# Altium schematic sheet Sheet1.SchDoc
size 420 x 297 mm; Address1: Address1; Address2: Address2; Address3: Address3; Address4: Address4; SheetNumber: 2; SheetTotal: 2; Scale: 1:1; Letter1Column: У; Разраб.: Иванов; Обозначение документа: АБВГ.123456.001 Э3; Пров.: Петров; Общее количество листов: 1; Наименование организации: ОАО "Ваша фирма"; Перв. применение: АБВГ.123456.001 Э3; Наименование изделия 1: Плата; Наименование изделия 2: Схема электрическая; Наименование изделия 3: принципиальная; Нач. отд.: Нач. отд.; Фамилия нач. отд.: Сидоров; CompanyName_1: ТПУ ИШНКБ ОЭИ; CompanyName_2: Группа 1А11
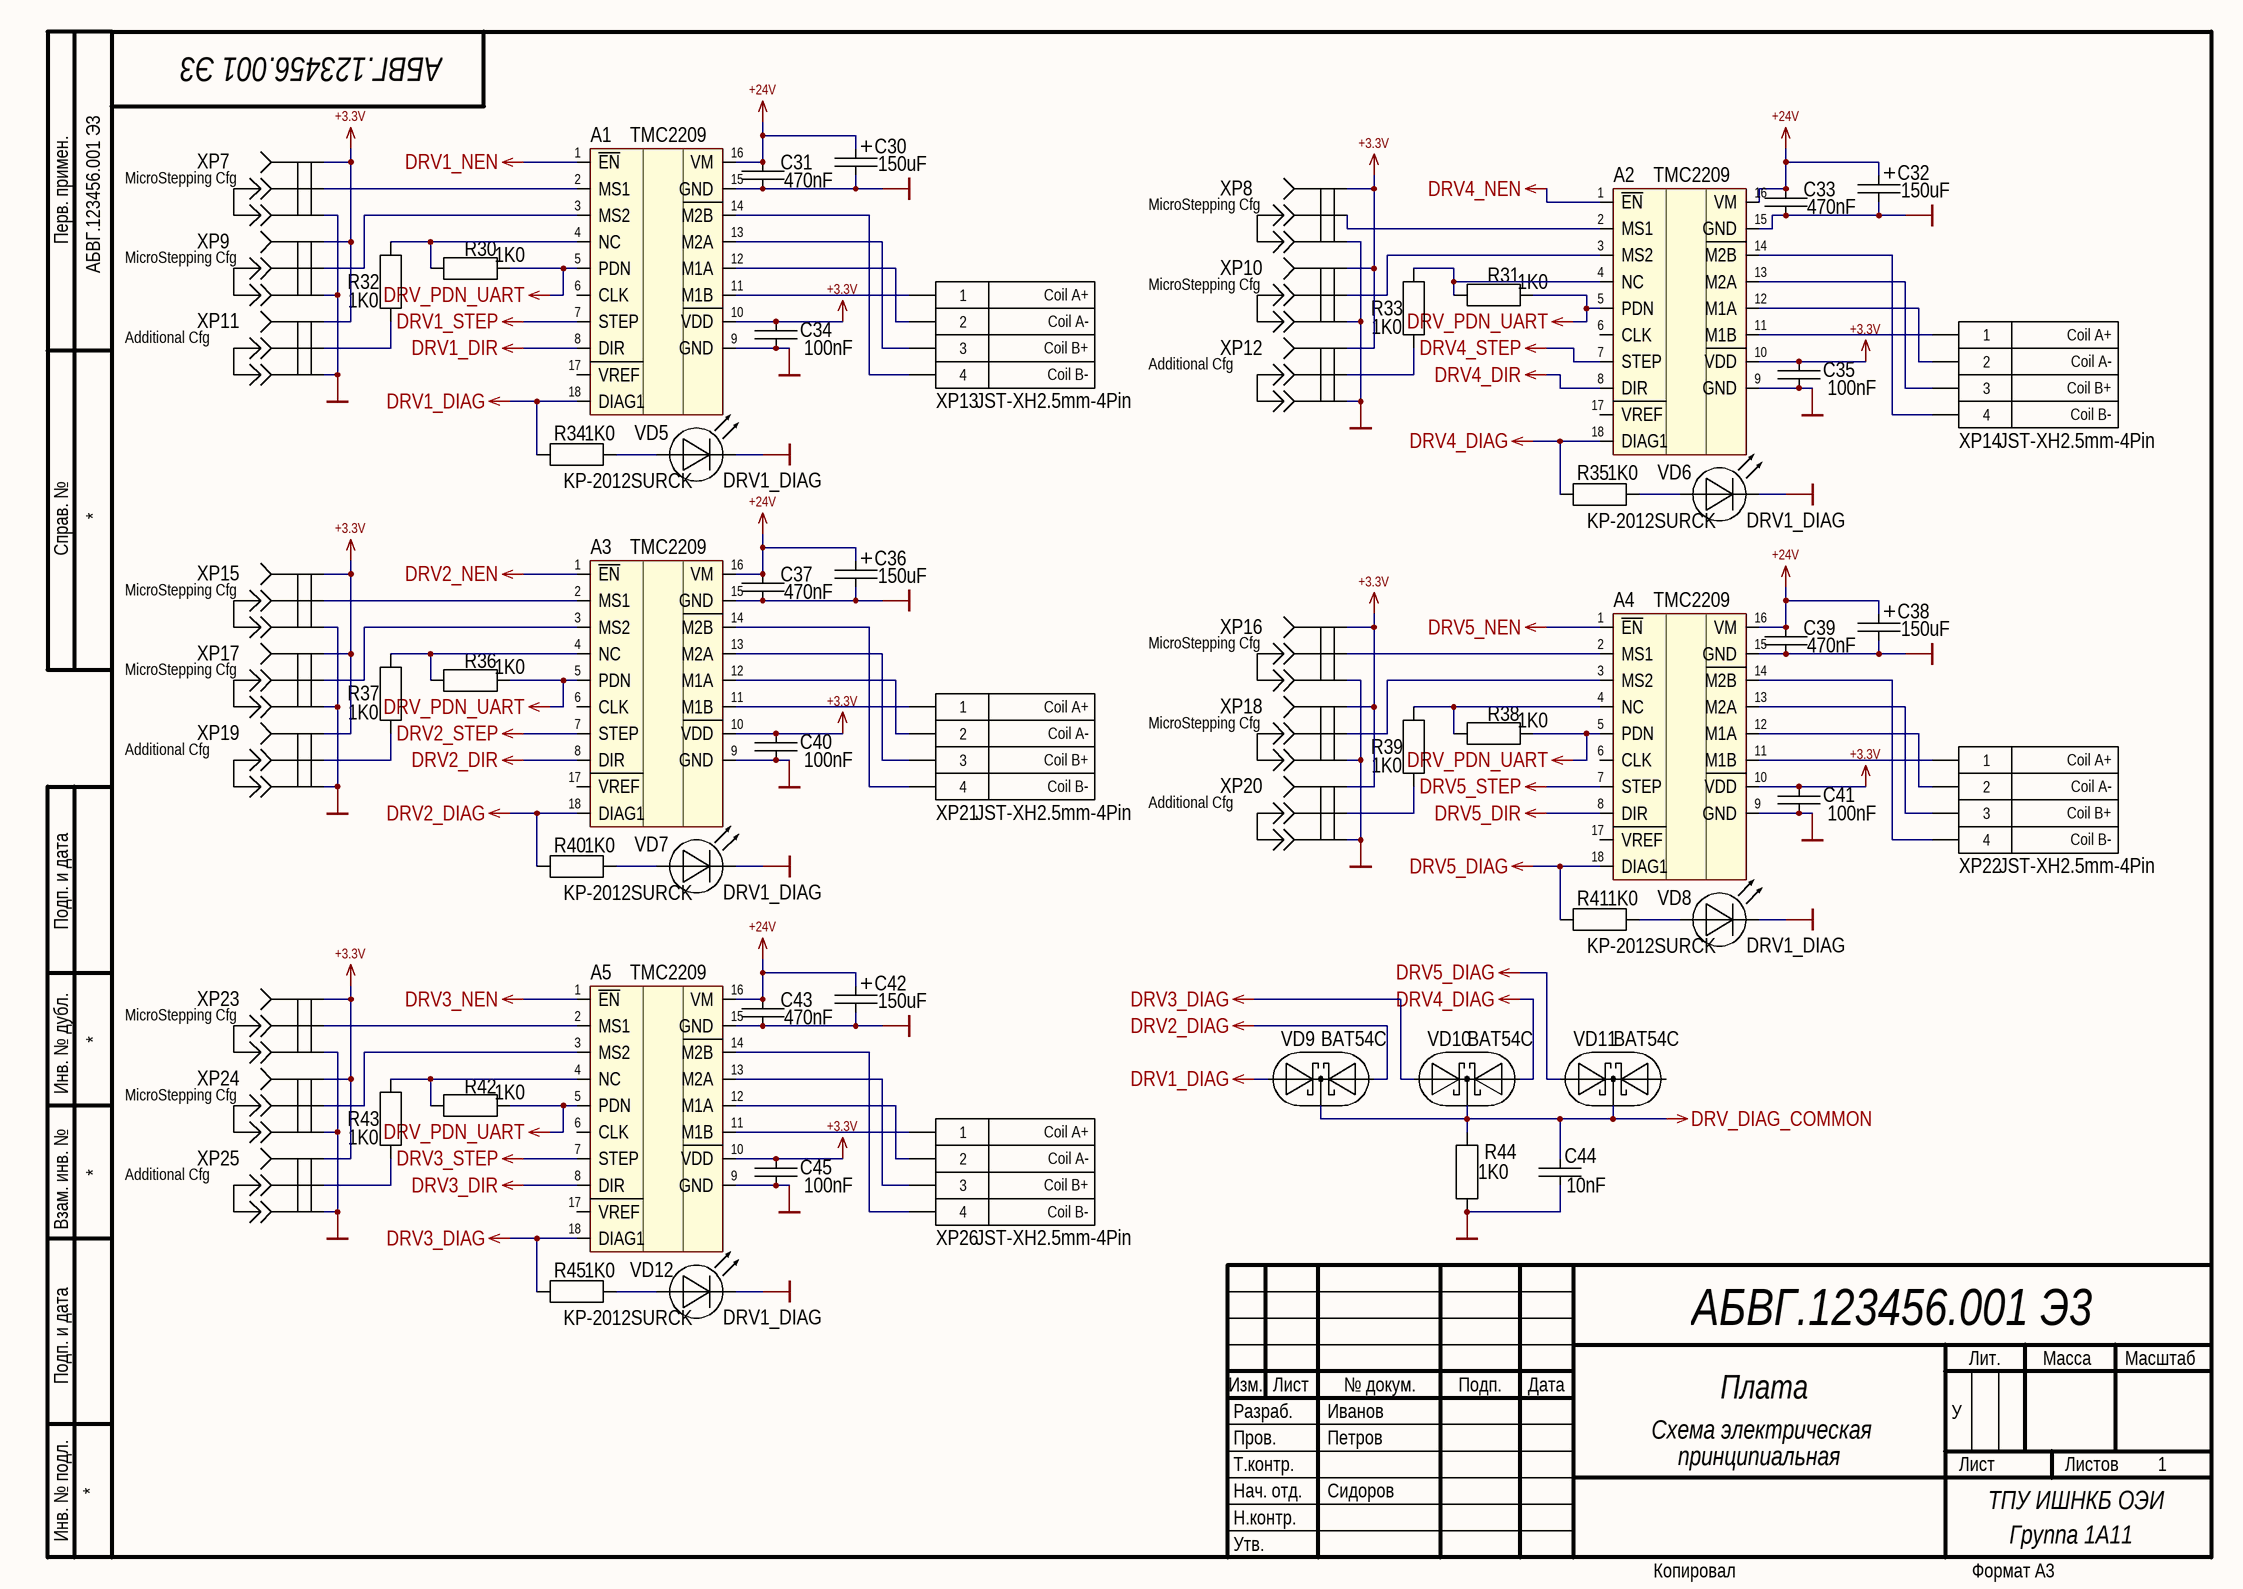
[diagram p0: Sheet1.SchDoc]

## Parts
A1  TMC2209  [TMC2209_module]
A2  TMC2209  [TMC2209_module]
A3  TMC2209  [TMC2209_module]
A4  TMC2209  [TMC2209_module]
A5  TMC2209  [TMC2209_module]
C30  value 150uF  [CapAl8X11.5X3.5RA]  (hidden comment: CapAl8X11.5X3.5mm 150uF, 35 V)
C31  value 470nF  [CAP0805]  (hidden comment: CAP0805 470nF±10%, 50 V, X7R)
C32  value 150uF  [CapAl8X11.5X3.5]  (hidden comment: CapAl8X11.5X3.5mm 150uF, 35 V)
C33  value 470nF  [CAP0805]  (hidden comment: CAP0805 470nF±10%, 50 V, X7R)
C34  value 100nF  [CAP0805]  (hidden comment: CAP0805 100nF±10%, 50 V, X7R)
C35  value 100nF  [CAP0805]  (hidden comment: CAP0805 100nF±10%, 50 V, X7R)
C36  value 150uF  [CapAl8X11.5X3.5RA]  (hidden comment: CapAl8X11.5X3.5mm 150uF, 35 V)
C37  value 470nF  [CAP0805]  (hidden comment: CAP0805 470nF±10%, 50 V, X7R)
C38  value 150uF  [CapAl8X11.5X3.5RA]  (hidden comment: CapAl8X11.5X3.5mm 150uF, 35 V)
C39  value 470nF  [CAP0805]  (hidden comment: CAP0805 470nF±10%, 50 V, X7R)
C40  value 100nF  [CAP0805]  (hidden comment: CAP0805 100nF±10%, 50 V, X7R)
C41  value 100nF  [CAP0805]  (hidden comment: CAP0805 100nF±10%, 50 V, X7R)
C42  value 150uF  [CapAl8X11.5X3.5RA]  (hidden comment: CapAl8X11.5X3.5mm 150uF, 35 V)
C43  value 470nF  [CAP0805]  (hidden comment: CAP0805 470nF±10%, 50 V, X7R)
C44  value 10nF  [CAP0805]  (hidden comment: CAP0805 10nF±5%, 50 V, NP0)
C45  value 100nF  [CAP0805]  (hidden comment: CAP0805 100nF±10%, 50 V, X7R)
R30  value 1K0  [RES0805]  (hidden comment: RES0805 1K0±5%)
R31  value 1K0  [RES0805]  (hidden comment: RES0805 1K0±5%)
R32  value 1K0  [RES0805]  (hidden comment: RES0805 1K0±5%)
R33  value 1K0  [RES0805]  (hidden comment: RES0805 1K0±5%)
R34  value 1K0  [RES0805]  (hidden comment: RES0805 1K0±5%)
R35  value 1K0  [RES0805]  (hidden comment: RES0805 1K0±5%)
R36  value 1K0  [RES0805]  (hidden comment: RES0805 1K0±5%)
R37  value 1K0  [RES0805]  (hidden comment: RES0805 1K0±5%)
R38  value 1K0  [RES0805]  (hidden comment: RES0805 1K0±5%)
R39  value 1K0  [RES0805]  (hidden comment: RES0805 1K0±5%)
R40  value 1K0  [RES0805]  (hidden comment: RES0805 1K0±5%)
R41  value 1K0  [RES0805]  (hidden comment: RES0805 1K0±5%)
R42  value 1K0  [RES0805]  (hidden comment: RES0805 1K0±5%)
R43  value 1K0  [RES0805]  (hidden comment: RES0805 1K0±5%)
R44  value 1K0  [RES0805]  (hidden comment: RES0805 1K0±5%)
R45  value 1K0  [RES0805]  (hidden comment: RES0805 1K0±5%)
VD5  Model: KP-2012SURCK  [LED0805 RED]  (hidden comment: KP-2012SURCK (2.0V, 25mA, LED0805 RED))
VD6  Model: KP-2012SURCK  [LED0805 RED]  (hidden comment: KP-2012SURCK (2.0V, 25mA, LED0805 RED))
VD7  Model: KP-2012SURCK  [LED0805 RED]  (hidden comment: KP-2012SURCK (2.0V, 25mA, LED0805 RED))
VD8  Model: KP-2012SURCK  [LED0805 RED]  (hidden comment: KP-2012SURCK (2.0V, 25mA, LED0805 RED))
VD9  Model: BAT54C  [SOT23-3 DIODE (A1A2C)]  (hidden comment: BAT54C (30 V, 200 mA, SOT23-3 DIODE (A1A2C)))
VD10  Model: BAT54C  [SOT23-3 DIODE (A1A2C)]  (hidden comment: BAT54C (30 V, 200 mA, SOT23-3 DIODE (A1A2C)))
VD11  Model: BAT54C  [SOT23-3 DIODE (A1A2C)]  (hidden comment: BAT54C (30 V, 200 mA, SOT23-3 DIODE (A1A2C)))
VD12  Model: KP-2012SURCK  [LED0805 RED]  (hidden comment: KP-2012SURCK (2.0V, 25mA, LED0805 RED))
XP7  PLS-3 1х3 Jumper  [PLS-1-3]  (value not drawn)
XP8  PLS-3 1х3 Jumper  [PLS-1-3]  (value not drawn)
XP9  PLS-3 1х3 Jumper  [PLS-1-3]  (value not drawn)
XP10  PLS-3 1х3 Jumper  [PLS-1-3]  (value not drawn)
XP11  PLS-3 1х3 Jumper  [PLS-1-3]  (value not drawn)
XP12  PLS-3 1х3 Jumper  [PLS-1-3]  (value not drawn)
XP13  JST-XH2.5mm-4Pin  Pin 4 Name: Coil B-  Pin 3 Name: Coil B+  Pin 2 Name: Coil A-  Pin 1 Name: Coil A+  [JST-XH2.5-4]
XP14  JST-XH2.5mm-4Pin  Pin 4 Name: Coil B-  Pin 3 Name: Coil B+  Pin 2 Name: Coil A-  Pin 1 Name: Coil A+  [JST-XH2.5-4]
XP15  PLS-3 1х3 Jumper  [PLS-1-3]  (value not drawn)
XP16  PLS-3 1х3 Jumper  [PLS-1-3]  (value not drawn)
XP17  PLS-3 1х3 Jumper  [PLS-1-3]  (value not drawn)
XP18  PLS-3 1х3 Jumper  [PLS-1-3]  (value not drawn)
XP19  PLS-3 1х3 Jumper  [PLS-1-3]  (value not drawn)
XP20  PLS-3 1х3 Jumper  [PLS-1-3]  (value not drawn)
XP21  JST-XH2.5mm-4Pin  Pin 4 Name: Coil B-  Pin 3 Name: Coil B+  Pin 2 Name: Coil A-  Pin 1 Name: Coil A+  [JST-XH2.5-4]
XP22  JST-XH2.5mm-4Pin  Pin 4 Name: Coil B-  Pin 3 Name: Coil B+  Pin 2 Name: Coil A-  Pin 1 Name: Coil A+  [JST-XH2.5-4]
XP23  PLS-3 1х3 Jumper  [PLS-1-3]  (value not drawn)
XP24  PLS-3 1х3 Jumper  [PLS-1-3]  (value not drawn)
XP25  PLS-3 1х3 Jumper  [PLS-1-3]  (value not drawn)
XP26  JST-XH2.5mm-4Pin  Pin 4 Name: Coil B-  Pin 3 Name: Coil B+  Pin 2 Name: Coil A-  Pin 1 Name: Coil A+  [JST-XH2.5-4]

## Nets
+3.3V: A1.10(VDD) A2.10(VDD) A3.10(VDD) A4.10(VDD) A5.10(VDD) C34.1 C35.1 C40.1 C41.1 C45.1 XP7.1 XP8.1 XP9.1 XP10.1 XP11.1 XP12.1 XP15.1 XP16.1 XP17.1 XP18.1 XP19.1 XP20.1 XP23.1 XP24.1 XP25.1
+24V: A1.16(VM) A2.16(VM) A3.16(VM) A4.16(VM) A5.16(VM) C30.1 C31.2 C32.1 C33.2 C36.1 C37.2 C38.1 C39.2 C42.1 C43.2
DRV1_DIAG: A1.18(DIAG1) R34.1 VD9.Anode1(First_Diod_Anode)
DRV1_DIR: A1.8(DIR)
DRV1_NEN: A1.1(~{EN})
DRV1_STEP: A1.7(STEP)
DRV2_DIAG: A3.18(DIAG1) R40.1 VD9.Anode2(Second_Diod_Anode)
DRV2_DIR: A3.8(DIR)
DRV2_NEN: A3.1(~{EN})
DRV2_STEP: A3.7(STEP)
DRV3_DIAG: A5.18(DIAG1) R45.1 VD10.Anode1(First_Diod_Anode)
DRV3_DIR: A5.8(DIR)
DRV3_NEN: A5.1(~{EN})
DRV3_STEP: A5.7(STEP)
DRV4_DIAG: A2.18(DIAG1) R35.1 VD10.Anode2(Second_Diod_Anode)
DRV4_DIR: A2.8(DIR)
DRV4_NEN: A2.1(~{EN})
DRV4_STEP: A2.7(STEP)
DRV5_DIAG: A4.18(DIAG1) R41.1 VD11.Anode1(First_Diod_Anode)
DRV5_DIR: A4.8(DIR)
DRV5_NEN: A4.1(~{EN})
DRV5_STEP: A4.7(STEP)
DRV_DIAG_COMMON: C44.2 R44.1 VD9.Common(Common_Cathodes) VD10.Common(Common_Cathodes) VD11.Common(Common_Cathodes)
DRV_PDN_UART: A1.5(PDN) A2.5(PDN) A3.5(PDN) A4.5(PDN) A5.5(PDN) R30.2 R31.2 R36.2 R38.2 R42.2
GND: A1.9(GND) A1.15(GND) A2.9(GND) A2.15(GND) A3.9(GND) A3.15(GND) A4.9(GND) A4.15(GND) A5.9(GND) A5.15(GND) C30.2 C31.1 C32.2 C33.1 C34.2 C35.2 C36.2 C37.1 C38.2 C39.1 C40.2 C41.2 C42.2 C43.1 C44.1 C45.2 R44.2 VD5.Cathode VD6.Cathode VD7.Cathode VD8.Cathode VD12.Cathode XP7.3 XP8.3 XP9.3 XP10.3 XP11.3 XP12.3 XP15.3 XP16.3 XP17.3 XP18.3 XP19.3 XP20.3 XP23.3 XP24.3 XP25.3
NetA1_2: A1.2(MS1) XP7.2
NetA1_3: A1.3(MS2) XP9.2
NetA1_4: A1.4(NC) R30.1 R32.2
NetA1_11: A1.11(M1B) XP13.1
NetA1_12: A1.12(M1A) XP13.2
NetA1_13: A1.13(M2A) XP13.3
NetA1_14: A1.14(M2B) XP13.4
NetA2_2: A2.2(MS1) XP8.2
NetA2_3: A2.3(MS2) XP10.2
NetA2_4: A2.4(NC) R31.1 R33.2
NetA2_11: A2.11(M1B) XP14.1
NetA2_12: A2.12(M1A) XP14.2
NetA2_13: A2.13(M2A) XP14.3
NetA2_14: A2.14(M2B) XP14.4
NetA3_2: A3.2(MS1) XP15.2
NetA3_3: A3.3(MS2) XP17.2
NetA3_4: A3.4(NC) R36.1 R37.2
NetA3_11: A3.11(M1B) XP21.1
NetA3_12: A3.12(M1A) XP21.2
NetA3_13: A3.13(M2A) XP21.3
NetA3_14: A3.14(M2B) XP21.4
NetA4_2: A4.2(MS1) XP16.2
NetA4_3: A4.3(MS2) XP18.2
NetA4_4: A4.4(NC) R38.1 R39.2
NetA4_11: A4.11(M1B) XP22.1
NetA4_12: A4.12(M1A) XP22.2
NetA4_13: A4.13(M2A) XP22.3
NetA4_14: A4.14(M2B) XP22.4
NetA5_2: A5.2(MS1) XP23.2
NetA5_3: A5.3(MS2) XP24.2
NetA5_4: A5.4(NC) R42.1 R43.2
NetA5_11: A5.11(M1B) XP26.1
NetA5_12: A5.12(M1A) XP26.2
NetA5_13: A5.13(M2A) XP26.3
NetA5_14: A5.14(M2B) XP26.4
NetR32_1: R32.1 XP11.2
NetR33_1: R33.1 XP12.2
NetR34_2: R34.2 VD5.Anode
NetR35_2: R35.2 VD6.Anode
NetR37_1: R37.1 XP19.2
NetR39_1: R39.1 XP20.2
NetR40_2: R40.2 VD7.Anode
NetR41_2: R41.2 VD8.Anode
NetR43_1: R43.1 XP25.2
NetR45_2: R45.2 VD12.Anode

Not connected (* = marked no-connect by the designer): A1 6(CLK) 17(VREF); A2 6(CLK) 17(VREF); A3 6(CLK) 17(VREF); A4 6(CLK) 17(VREF); A5 6(CLK) 17(VREF); VD11 Anode2(Second_Diod_Anode)

## Notes on the sheet
- (near XP7) MicroStepping Cfg
- (near XP8) MicroStepping Cfg
- MicroStepping Cfg
- Additional Cfg
- (near VD5) DRV1_DIAG
- (near VD6) DRV1_DIAG
- (near XP15) MicroStepping Cfg
- (near XP16) MicroStepping Cfg
- (near VD7) DRV1_DIAG
- (near VD8) DRV1_DIAG
- (near XP23) MicroStepping Cfg
- (near VD12) DRV1_DIAG
- Перв. примен.
- Справ. №
- Подп. и дата
- Инв. № дубл.
- Взам. инв. №
- Разраб.
- Изм.
- Лист
- № докум.
- Подп.
- Дата
- Лит.
- Масса
- Масштаб
- Пров.
- Т.контр.
- Листов
- Инв. № подл.
- Утв.
- Н.контр.
- Копировал
- Формат А3

## Library data of the parts
A1-A5 = TMC2209_module
C30 C32 C36 C38 C42 = CAL0170: LOW IMPEDANCE ALUMINUM ELECTROLYTIC CAPACITORS CapAl8X11.5X3.5 150uF±20% 35 V 105⁰С; PartNumber: EEUFC1V151; Manufacture: Panasonic; Tolerance: ±20%; Voltage: 35 V; Current: 555 mA (100 kHz); ID: CAL0170; Series: FC; Case: 8X11.5X3.5mm; Temperature: 105⁰С; ComponentLink1Description: LOW IMPEDANCE ALUMINUM ELECTROLYTIC CAPACITORS; ComponentLink1URL: D:\Altium\AD24\Library\Passives Library\DataSheet\Aluminum Electrolytic Capacitors (Panasonic).pdf
C31 C33 C37 C39 C43 = C0070: GENERAL PURPOSE CLASS 2 CERAMIC CAPACITORS CAP0805 470nF±10% 50 V X7R; PartNumber: CC0805KRX7R9BB474; Manufacture: Yageo; Tolerance: ±10%; ID: C0070; Voltage: 50 V; Case: 0805 (2.0*1.25mm); Dielectric: X7R; ComponentLink1Description: GENERAL PURPOSE CLASS 2 CERAMIC CAPACITORS; ComponentLink1URL: D:\Altium\AD24\Library\Passives Library\DataSheet\General Purpose & High Capacitance CERAMIC CAPACITOR CLASS II (Yageo).pdf
C34 C35 C40 C41 C45 = C0066: GENERAL PURPOSE CLASS 2 CERAMIC CAPACITORS CAP0805 100nF±10% 50 V X7R; PartNumber: CC0805KRX7R9BB104; Manufacture: Yageo; Tolerance: ±10%; ID: C0066; Voltage: 50 V; Case: 0805 (2.0*1.25mm); Dielectric: X7R; ComponentLink1Description: GENERAL PURPOSE CLASS 2 CERAMIC CAPACITORS; ComponentLink1URL: D:\Altium\AD24\Library\Passives Library\DataSheet\General Purpose & High Capacitance CERAMIC CAPACITOR CLASS II (Yageo).pdf
C44 = C0228: GENERAL PURPOSE CLASS 1 CERAMIC CAPACITORS CAP0805 10nF±5% 50 V NP0; PartNumber: CC0805JKNPO9BN103; Manufacture: Yageo; Tolerance: ±5%; ID: C0228; Voltage: 50 V; Case: 0805 (2.0*1.25mm); Dielectric: NP0; ComponentLink1Description: GENERAL PURPOSE CLASS 1 CERAMIC CAPACITORS; ComponentLink1URL: D:\Altium\AD24\Library\Passives Library\DataSheet\General Purpose & High Capacitance CERAMIC CAPACITOR CLASS I (Yageo).pdf
R30-R45 = R0429: GENERAL PURPOSE CHIP RESISTORS RES0805 1K0±5% 150V 0.125W; PartNumber: RC0805JR-071K0L; Manufacture: Yageo; Tolerance: ±5%; ID: R0429; Case: 0805 (2.0*1.25mm); Voltage: 150V; Power: 0.125W; ComponentLink1Description: GENERAL PURPOSE CHIP RESISTORS; ComponentLink1URL: D:\Altium\AD24\Library\Passives Library\DataSheet\GENERAL PURPOSE CHIP RESISTORS (Yageo).pdf
VD5-VD8 VD12 = VD005: LED SMD KP-2012SURCK (2.0V, 25mA, LED0805 RED); ID: VD005; Color: SUPER BRIGHT RED; Luminous Intensity: 80mcd; Voltage: 2.0V; Current: 25mA; Case: 0805; PartNumber: KP-2012SURCK; ComponentLink1Description: SMD Red LED 0805; ComponentLink1URL: D:\Altium\AD24\Library\myLibrary\Discrete Semiconductors Library\DataSheet\KP-2012SURCK(KGB).pdf
VD9-VD11 = VD0004: DIODE BAT54C (30 V, 200 mA, SOT23-3 DIODE (A1A2C), NXP); PartNumber: BAT54C,215; ID: VD0004; Voltage: 30 V; Current: 200 mA; Case: SOT23-3; Manufacture: NXP; ComponentLink1Description: BAT54C Dual Common Cathode Schottky Diodes; ComponentLink1URL: D:\Altium\AD24\Library\myLibrary\Discrete Semiconductors Library\DataSheet\BAT54_Series(NXP).pdf
XP7-XP12 XP15-XP20 XP23-XP25 = PLS-3 1х3 Jumper: PLS-3, Вилка штыревая 2.54мм 1х3pin прямая (тип D1)
XP13 XP14 XP21 XP22 XP26 = JST-XH2.5mm-4Pin: 2.5 mm pitch/Wire-to-Board connectors. Male Curved Needle Plug; System: Connector